# Altium schematic sheet S7CAS-PLEIADES-CARTE-MERE_P02_USB.SchDoc
size Tabloid; DocumentNumber: 11; SheetNumber: 11; SheetTotal: 14; Size: 11x17; Sheet_Name: USB
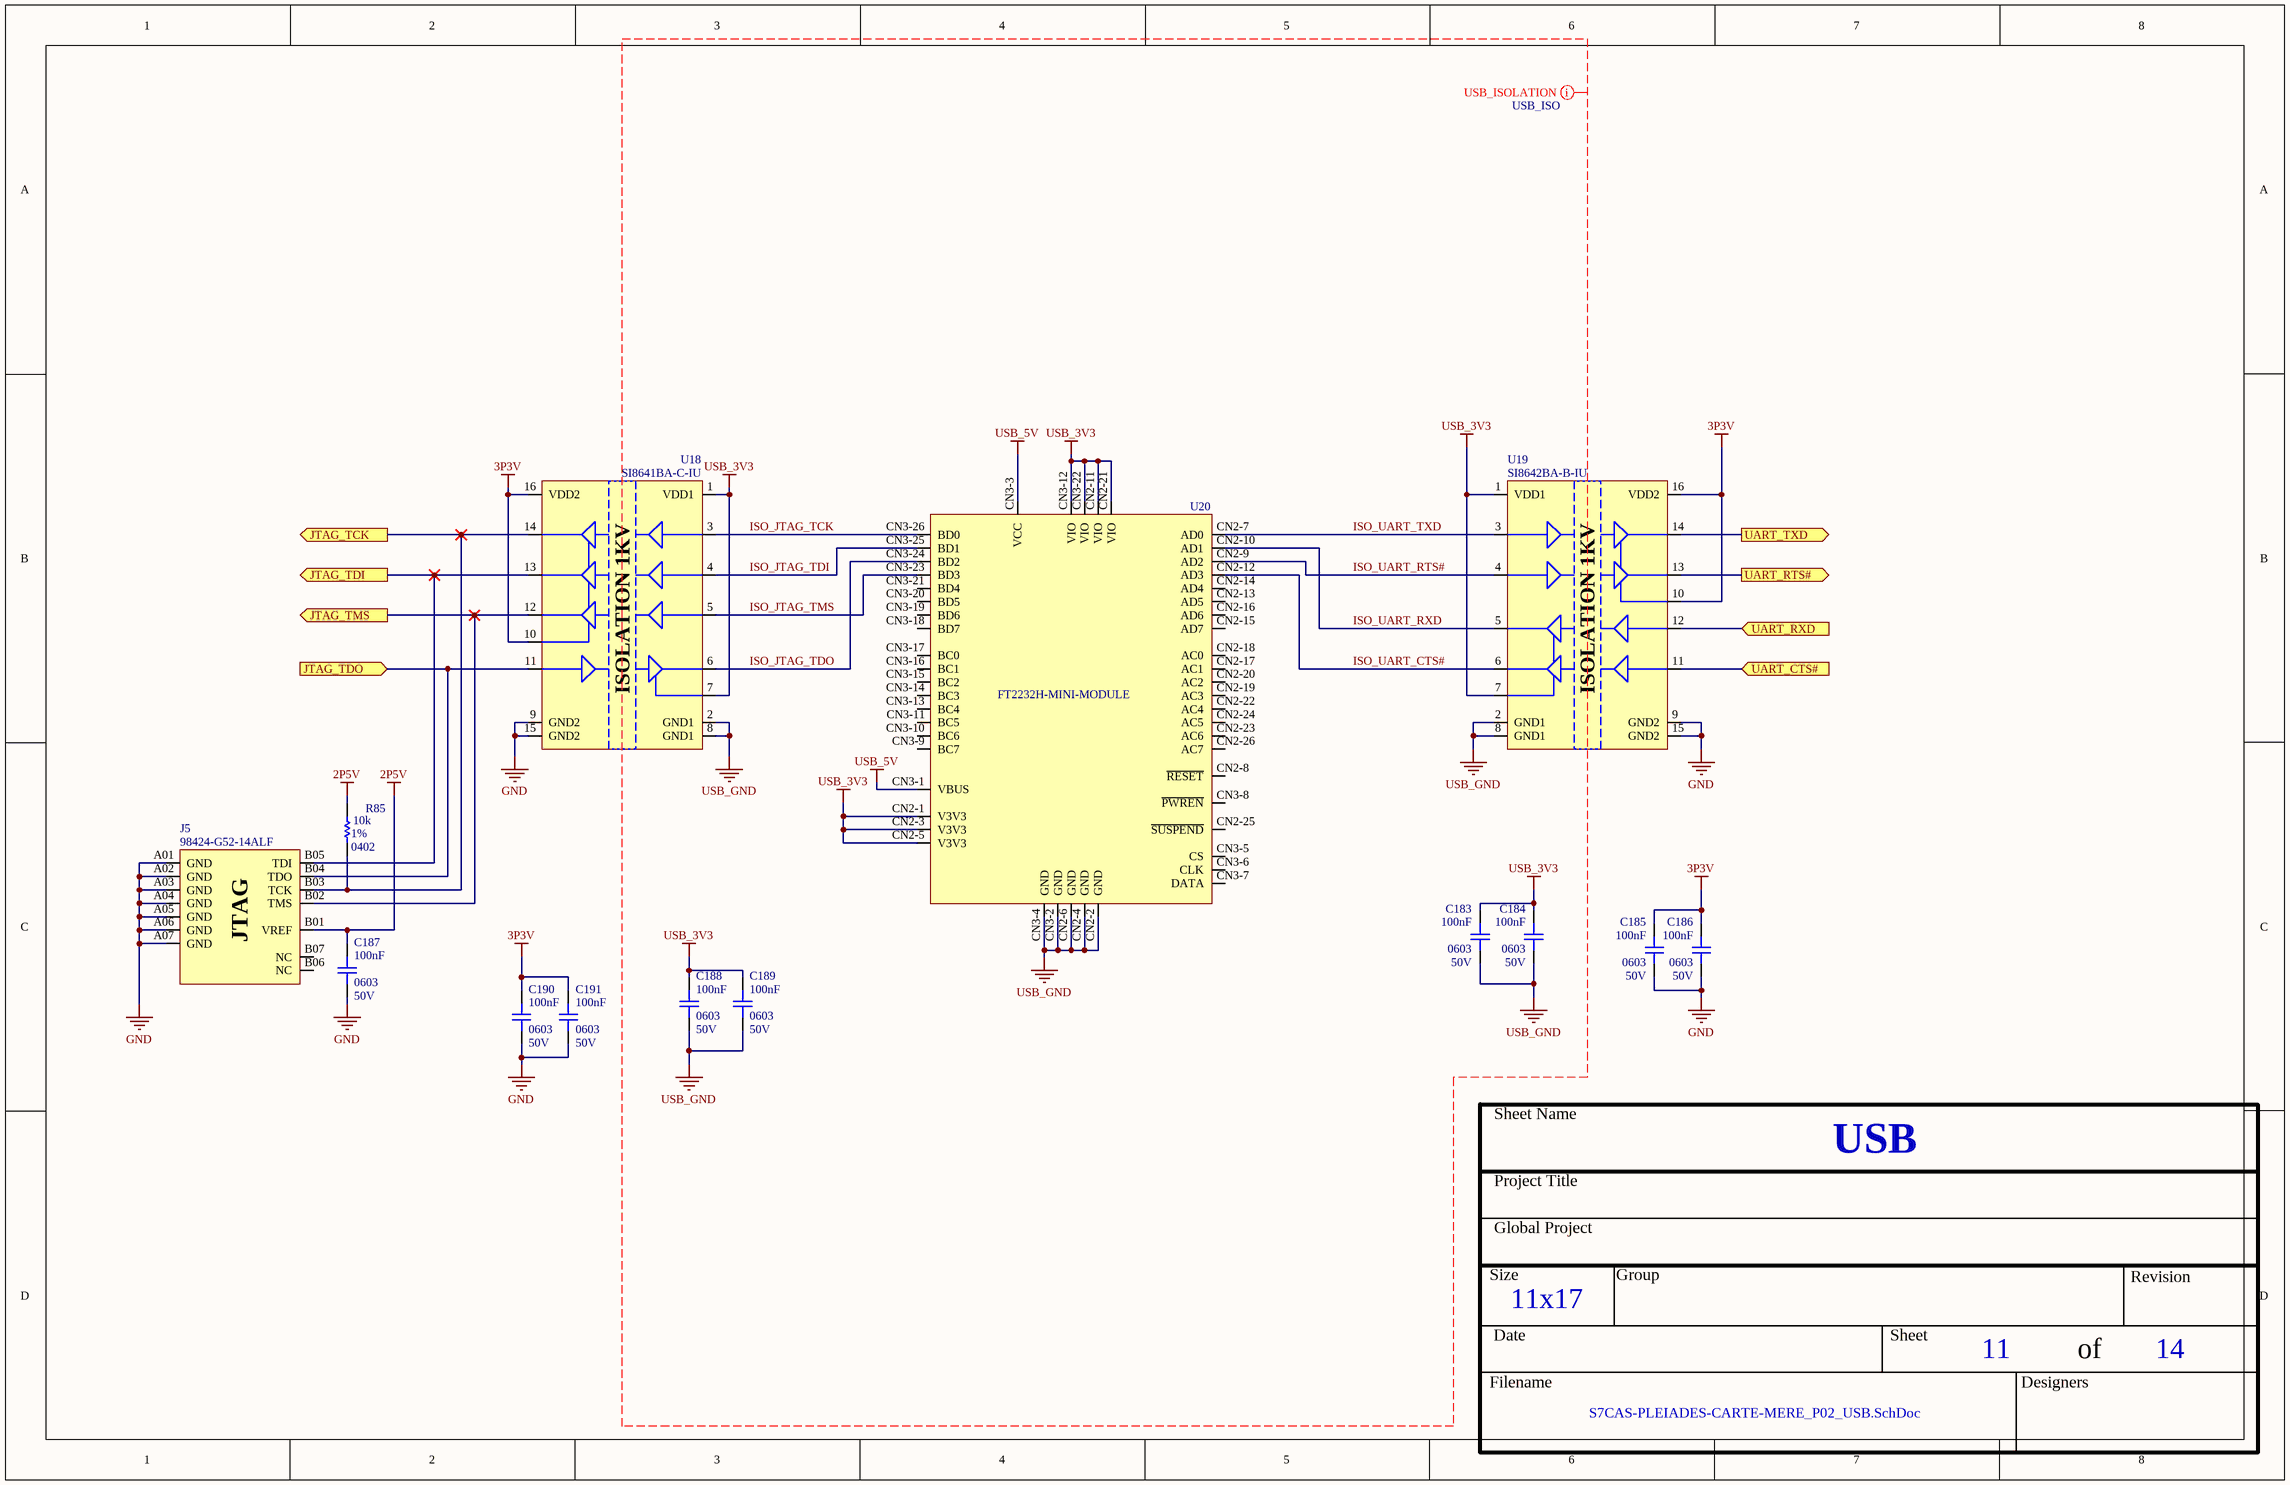
[diagram p0: S7CAS-PLEIADES-CARTE-MERE_P02_USB.SchDoc]

## Parts
C183  value 100nF  Voltage: 50V  Package: 0603  [CAP_0603]  (hidden comment: CAP - 0603)
C184  value 100nF  Voltage: 50V  Package: 0603  [CAP_0603]  (hidden comment: CAP - 0603)
C185  value 100nF  Voltage: 50V  Package: 0603  [CAP_0603]  (hidden comment: CAP - 0603)
C186  value 100nF  Voltage: 50V  Package: 0603  [CAP_0603]  (hidden comment: CAP - 0603)
C187  value 100nF  Voltage: 50V  Package: 0603  [CAP_0603]  (hidden comment: CAP - 0603)
C188  value 100nF  Voltage: 50V  Package: 0603  [CAP_0603]  (hidden comment: CAP - 0603)
C189  value 100nF  Voltage: 50V  Package: 0603  [CAP_0603]  (hidden comment: CAP - 0603)
C190  value 100nF  Voltage: 50V  Package: 0603  [CAP_0603]  (hidden comment: CAP - 0603)
C191  value 100nF  Voltage: 50V  Package: 0603  [CAP_0603]  (hidden comment: CAP - 0603)
J5  98424-G52-14ALF  [CON_JTAG_98424-G52-14ALF]
R85  value 10k  Package: 0402  Precision: 1%  [RES_0402]  (hidden comment: RES - 0402)
U18  SI8641BA-C-IU  [ISO_SI8642BA-B-IU]
U19  SI8642BA-B-IU  [ISO_SI8642BA-B-IU]
U20  FT2232H-MINI-MODULE  [COM_USB_FT2232H-MINI-MODULE]

## Ports
JTAG_TCK (out), JTAG_TDI (out), JTAG_TDO (in), JTAG_TMS (out), UART_CTS# (in), UART_RTS# (out), UART_RXD (in), UART_TXD (out)

## Nets
2P5V: C187.2 J5.B01(VREF) R85.2
3P3V: C185.2 C186.2 C190.2 C191.2 U18.10(EN2) U18.16(VDD2) U19.10(EN2) U19.16(VDD2)
GND: C185.1 C186.1 C187.1 C190.1 C191.1 J5.A01(GND) J5.A02(GND) J5.A03(GND) J5.A04(GND) J5.A05(GND) J5.A06(GND) J5.A07(GND) U18.9(GND2) U18.15(GND2) U19.9(GND2) U19.15(GND2)
USB_3V3: C183.2 C184.2 C188.2 C189.2 U18.1(VDD1) U18.7(EN1) U19.1(VDD1) U19.7(EN1) U20.CN2-1(V3V3) U20.CN2-3(V3V3) U20.CN2-5(V3V3) U20.CN2-11(VIO) U20.CN2-21(VIO) U20.CN3-12(VIO) U20.CN3-22(VIO)
USB_5V: U20.CN3-1(VBUS) U20.CN3-3(VCC)
USB_GND: C183.1 C184.1 C188.1 C189.1 U18.2(GND1) U18.8(GND1) U19.2(GND1) U19.8(GND1) U20.CN2-2(GND) U20.CN2-4(GND) U20.CN2-6(GND) U20.CN3-2(GND) U20.CN3-4(GND)
ISO_JTAG_TCK: U18.3(A1) U20.CN3-26(BD0)
ISO_JTAG_TDI: U18.4(A2) U20.CN3-25(BD1)
ISO_JTAG_TDO: U18.6(A4) U20.CN3-24(BD2)
ISO_JTAG_TMS: U18.5(A3) U20.CN3-23(BD3)
ISO_UART_CTS#: U19.6(A4) U20.CN2-12(AD3)
ISO_UART_RTS#: U19.4(A2) U20.CN2-9(AD2)
ISO_UART_RXD: U19.5(A3) U20.CN2-10(AD1)
ISO_UART_TXD: U19.3(A1) U20.CN2-7(AD0)
JTAG_TCK: J5.B03(TCK) R85.1 U18.14(B1) ; port JTAG_TCK
JTAG_TDI: J5.B05(TDI) U18.13(B2) ; port JTAG_TDI
JTAG_TDO: J5.B04(TDO) U18.11(B4) ; port JTAG_TDO
JTAG_TMS: J5.B02(TMS) U18.12(B3) ; port JTAG_TMS
UART_CTS#: U19.11(B4) ; port UART_CTS#
UART_RTS#: U19.13(B2) ; port UART_RTS#
UART_RXD: U19.12(B3) ; port UART_RXD
UART_TXD: U19.14(B1) ; port UART_TXD

Not connected (* = marked no-connect by the designer): J5 B06(NC) B07(NC); U20 CN2-8(~{RESET}) CN2-13(AD5) CN2-14(AD4) CN2-15(AD7) CN2-16(AD6) CN2-17(AC1) CN2-18(AC0) CN2-19(AC3) CN2-20(AC2) CN2-22(AC4) CN2-23(AC6) CN2-24(AC5) CN2-25(~{SUSPEND}) CN2-26(AC7) CN3-5(CS) CN3-6(CLK) CN3-7(DATA) CN3-8(~{PWREN}) CN3-9(BC7) CN3-10(BC6) CN3-11(BC5) CN3-13(BC4) CN3-14(BC3) CN3-15(BC2) CN3-16(BC1) CN3-17(BC0) CN3-18(BD7) CN3-19(BD6) CN3-20(BD5) CN3-21(BD4)

## Layout directives
net class USB_ISO: ISO_JTAG_TCK, ISO_JTAG_TDI, ISO_JTAG_TDO, ISO_JTAG_TMS, ISO_UART_CTS#, ISO_UART_RTS#, ISO_UART_RXD, ISO_UART_TXD, USB_3V3, USB_5V, USB_GND

## Notes on the sheet
- (near U20) CS, CLK & DATA sont des signaux connectés sur le mini module à l'EEPROM
- Sheet Name
- Project Title
- Global Project
- Size
- Group
- Revision
- Date
- Sheet
- of
- Filename
- Designers
- (in symbol CONN_JTAG_98424-G52-14ALF) JTAG
- (in symbol ISO_SI8641BA-C-IU) ISOLATION 1KV
- (in symbol ISO_SI8642BA-B-IU) ISOLATION 1KV

## Library data of the parts
C183-C191 = CAP - 0603: Precision: 10%; Current: *; CreatedBy: Jonathan Bouchard; Power: *
J5 = CONN_JTAG_98424-G52-14ALF: CONN -  JTAG HEADER XILINX - 14-SMD; Mfg: Amphenol; Voltage: *; Current: *; Power: *; Mfg Part Number: 98424-G52-14ALF; HelpURL: http://portal.fciconnect.com/Comergent//fci/drawing/98424.pdf; CreatedBy: Jonathan Bouchard; Temperature: *; Value: *; Precision: *; Package: 14-SMD; Supplier 1: Digikey; Supplier Part Number 1: 609-2643-1-ND
R85 = RES - 0402: Voltage: 50V; Power: 1/16W; Current: *; CreatedBy: Jonathan Bouchard
U18 = ISO_SI8641BA-C-IU: ISO - DIGITAL ISOLATOR 1KV 4CH 3:1 GEN PURP -  SOP-16; Voltage: 2.5 V ~ 5.5 V; Mfg: Silicon Labs; Current: *; Power: *; Mfg Part Number: SI8641BA-C-IU; HelpURL: http://www.silabs.com/Support%20Documents/TechnicalDocs/si864x-datasheet.pdf; CreatedBy: Jonathan Bouchard; Temperature: -40°C ~ 125°C; Value: *; Precision: *; Package: SOP-16; Supplier 1: Digikey; Supplier Part Number 1: SI8641BA-C-IU-ND
U19 = ISO_SI8642BA-B-IU: ISO - DIGITAL ISOLATOR 1KV 4CH 2:2 GEN PURP -  SOP-16; Voltage: 2.5 V ~ 5.5 V; Mfg: Silicon Labs; Current: *; Power: *; Mfg Part Number: SI8642BA-B-IU; HelpURL: http://www.silabs.com/Support%20Documents/TechnicalDocs/si864x-datasheet.pdf; CreatedBy: Jonathan Bouchard; Temperature: -40°C ~ 125°C; Value: *; Precision: *; Package: SOP-16; Supplier 1: Digikey; Supplier Part Number 1: 336-2091-5-ND
U20 = COM_USB_FT2232H-MINI-MODULE: COM - USB FTDI FT2232H Mini-Module - TH; Mfg: Micrel; Voltage: *; Current: *; Power: *; Mfg Part Number: FT2232H-MINI-MODULE; HelpURL: http://www.ftdichip.com/Support/Documents/DataSheets/Modules/DS_FT2232H_Mini_Module.pdf; CreatedBy: Jonathan Bouchard; Temperature: *; Value: *; Precision: *; Package: TH; Supplier 1: Digikey; Supplier Part Number 1: 768-1030-ND